# Altium schematic sheet DE29.SchDoc
size A4; SheetNumber: 1; SheetTotal: 1; SPICEModelCacheZMIRQRVP: <root> / <DocumentId>ZMIRQRVP</DocumentId> / <CacheFrame Number="0"> / <Model Name="diode" Kind="MDL"> / <Text>*Default Diode / *Diode Pinout: A,K / .MODEL DIODE D()</Text> / </Model> / <Model Name="zener" Kind="MDL"> / <Text>*ZENER / *Default Zener 10V @ 10mA / *Zener Diode Pinout: A,K / .MODEL ZENER D( BV=10 IBV=10E-3 )</Text> / </Model> / <Model Name="bridge" Kind="CKT"> / <Text>*Default Diode Bridge Rectifier / *Connections: / *              V- / *              | AC1 / *              | | V+ / *              | | | AC2 / *              | | | | / .SUBCKT BRIDGE 1 2 3 4 / D1 1 2 DMOD / D2 1 4 DMOD / D3 2 3 DMOD / D4 4 3 DMOD / .MODEL DMOD D () / .ENDS BRIDGE</Text> / </Model> / <Model Name="2n3904" Kind="MDL"> / <Text>*2N3904 / *Si 310mW  40V 200mA 300MHz pkg:TO-92B 1,2,3 / .MODEL 2N3904 NPN(IS=1.4E-14 BF=300 VAF=100 IKF=0.025 ISE=3E-13 / + BR=7.5 RC=2.4 CJE=4.5E-12 TF=4E-10 CJC=3.5E-12 TR=2.1E-8 XTB=1.5 KF=9E-16 )</Text> / </Model> / </CacheFrame> / </root>
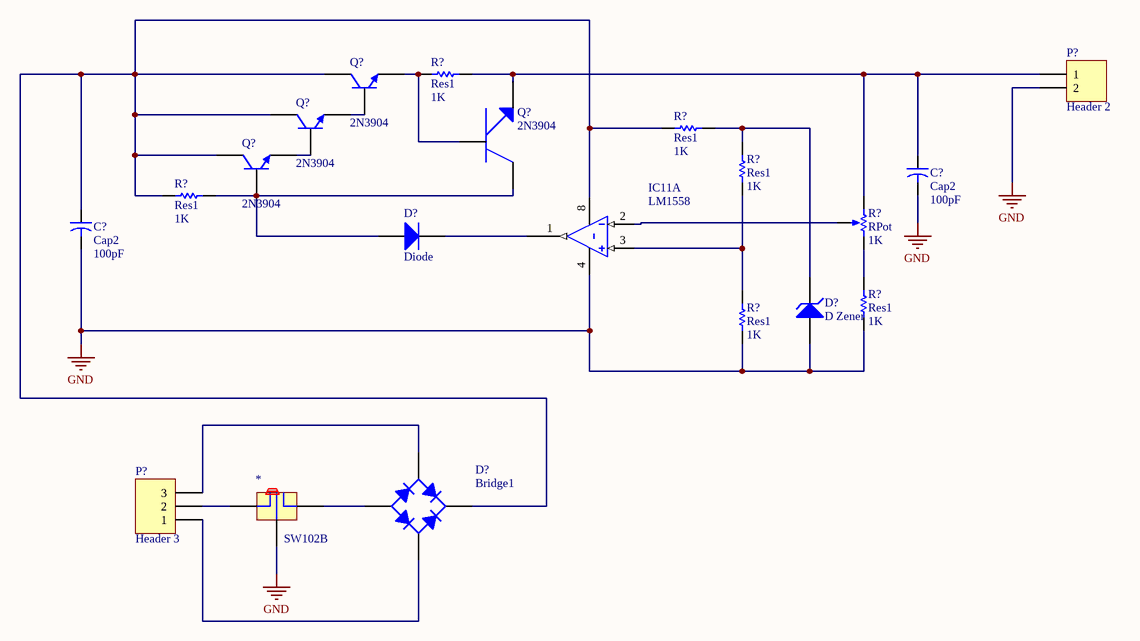
[diagram p0: DE29.SchDoc]

## Parts
(Parts that share a designator on the sheet are numbered #1, #2 ... from top to bottom, then left to right.)
*  SW102B
C?#1  Cap2  value 100pF  [CAPR5-4X5]
C?#2  Cap2  value 100pF  [CAPR5-4X5]
D?#1  Diode  [SMC]
D?#2  D Zener  [DIODE-0.7]
D?#3  Bridge1  [D-38]
IC11A  LM1558
P?#1  Header 2  [HDR1X2]
P?#2  Header 3  [HDR1X3]
Q?#1  2N3904  [TO-92A]
Q?#2  2N3904
Q?#3  2N3904  [TO-92A]
Q?#4  2N3904  [TO-92A]
R?#1  Res1  value 1K  [AXIAL-0.3]
R?#2  Res1  value 1K  [AXIAL-0.3]
R?#3  Res1  value 1K  [AXIAL-0.3]
R?#4  Res1  value 1K  [AXIAL-0.3]
R?#5  RPot  value 1K  [VR5]
R?#6  Res1  value 1K  [AXIAL-0.3]
R?#7  Res1  value 1K  [AXIAL-0.3]

## Nets
GND: *.19 C?#1.2 C?#2.2 D?#2.1(A) IC11A.4 P?#1.2 R?#6.1 R?#7.1
Net*_18: *.18 P?#2.2
Net*_20: *.20 D?#3.3(A)
NetC?#1_1: C?#1.1 P?#1.1 Q?#2.14 R?#1.2 R?#5.1(TOP)
NetC?#2_1: C?#2.1 D?#3.1(K) IC11A.8 Q?#1.3(C) Q?#3.3(C) Q?#4.3(C) R?#2.1 R?#3.1
NetD?#1_1: D?#1.1(A) Q?#2.13 Q?#4.2(B) R?#3.2
NetD?#1_2: D?#1.2(K) IC11A.1
NetD?#2_2: D?#2.2(K) R?#2.2 R?#4.2
NetD?#3_2: D?#3.2(C) P?#2.1
NetD?#3_4: D?#3.4(C) P?#2.3
NetIC11A_2: IC11A.2 R?#5.3(TAP)
NetIC11A_3: IC11A.3 R?#4.1 R?#7.2
NetQ?#1_1: Q?#1.1(E) Q?#2.12 R?#1.1
NetQ?#1_2: Q?#1.2(B) Q?#3.1(E)
NetQ?#3_2: Q?#3.2(B) Q?#4.1(E)
NetR?#5_2: R?#5.2(BOT) R?#6.2

## Library data of the parts
C?#1 C?#2 = Cap2: Capacitor; Published: 23-Sep-2002; PackageReference: CAPR5-4X5; Publisher: Altium Limited; PackageDescription: Capacitor; 2 Leads
D?#1 = Diode: Default Diode; Published: 8-Jun-2000; LatestRevisionDate: 17-Jul-2002; LatestRevisionNote: Re-released for DXP Platform.; PackageVersion: Sep-1996; PackageReference: SMC; Publisher: Altium Limited; PackageDescription: DO-214-AB/SMC; 2 C-Bend Leads; Body 7.9 x 5.9 mm, inc. leads (LxW); Code_JEDEC: DO-214-AB
D?#2 = D Zener: Zener Diode; Published: 8-Jun-2000; LatestRevisionDate: 17-Jul-2002; LatestRevisionNote: Re-released for DXP Platform.; PackageReference: DIODE-0.7; Publisher: Altium Limited; PackageDescription: Diode, Thru-Hole; 2 Leads; 0.7 in Pin Spacing
D?#3 = Bridge1: Full Wave Diode Bridge; Published: 8-Jun-2000; LatestRevisionDate: 29-May-2009; LatestRevisionNote: Sch pins A & K swapped.; DatasheetVersion: E2732B; PackageReference: D-38; Publisher: Altium Limited; PackageDescription: Bridge Rectifier; 4 Terminals; Body 9.4 x 9.4 mm (typ); Pitch 5.08 mm
P?#1 = Header 2: Header, 2-Pin; LatestRevisionDate: 17-Jul-2002; LatestRevisionNote: Re-released for DXP Platform.; Publisher: Altium Limited
P?#2 = Header 3: Header, 3-Pin; LatestRevisionDate: 17-Jul-2002; LatestRevisionNote: Re-released for DXP Platform.; Publisher: Altium Limited
Q?#1 Q?#3 Q?#4 = 2N3904: NPN General Purpose Amplifier; Published: 8-Jun-2000; LatestRevisionDate: 15-Jan-2003; LatestRevisionNote: PCB Footprint 'BCY-W3/D4.7' replaced; DatasheetVersion: 1997; PackageVersion: Sep-1998; PackageReference: TO-92A; Publisher: Altium Limited; PackageDescription: TO, Flat Index; 3 In-Line, Axial Leads; Body Dia. 4.5mm; Leads 0.51 x 0.48 mm (max); ComponentLink1Description: Manufacturer Link; ComponentLink1URL: http://www.fairchildsemi.com/; ComponentLink2Description: Datasheet; ComponentLink2URL: http://www.fairchildsemi.com/ds/2N%2F2N3904.pdf
Q?#2 = Component_1
R?#1-R?#4 R?#6 R?#7 = Res1: Resistor; Published: 8-Jun-2000; LatestRevisionDate: 17-Jul-2002; LatestRevisionNote: Re-released for DXP Platform.; PackageReference: AXIAL-0.3; Publisher: Altium Limited; PackageDescription: Axial Device, Thru-Hole; 2 Leads; 0.3 in Pin Spacing
R?#5 = RPot: Potentiometer; Sim Note: Enter the Resistance value and the set point into parameter fields.; Set Position: 0.5; Published: 8-Jun-2000; LatestRevisionDate: 17-Jul-2002; LatestRevisionNote: Re-released for DXP Platform.; PackageReference: VR5; Publisher: Altium Limited; PackageDescription: Variable Resistor, Thru-Hole; 3 Leads